# EAGLE design display (EAGLE 6.0)
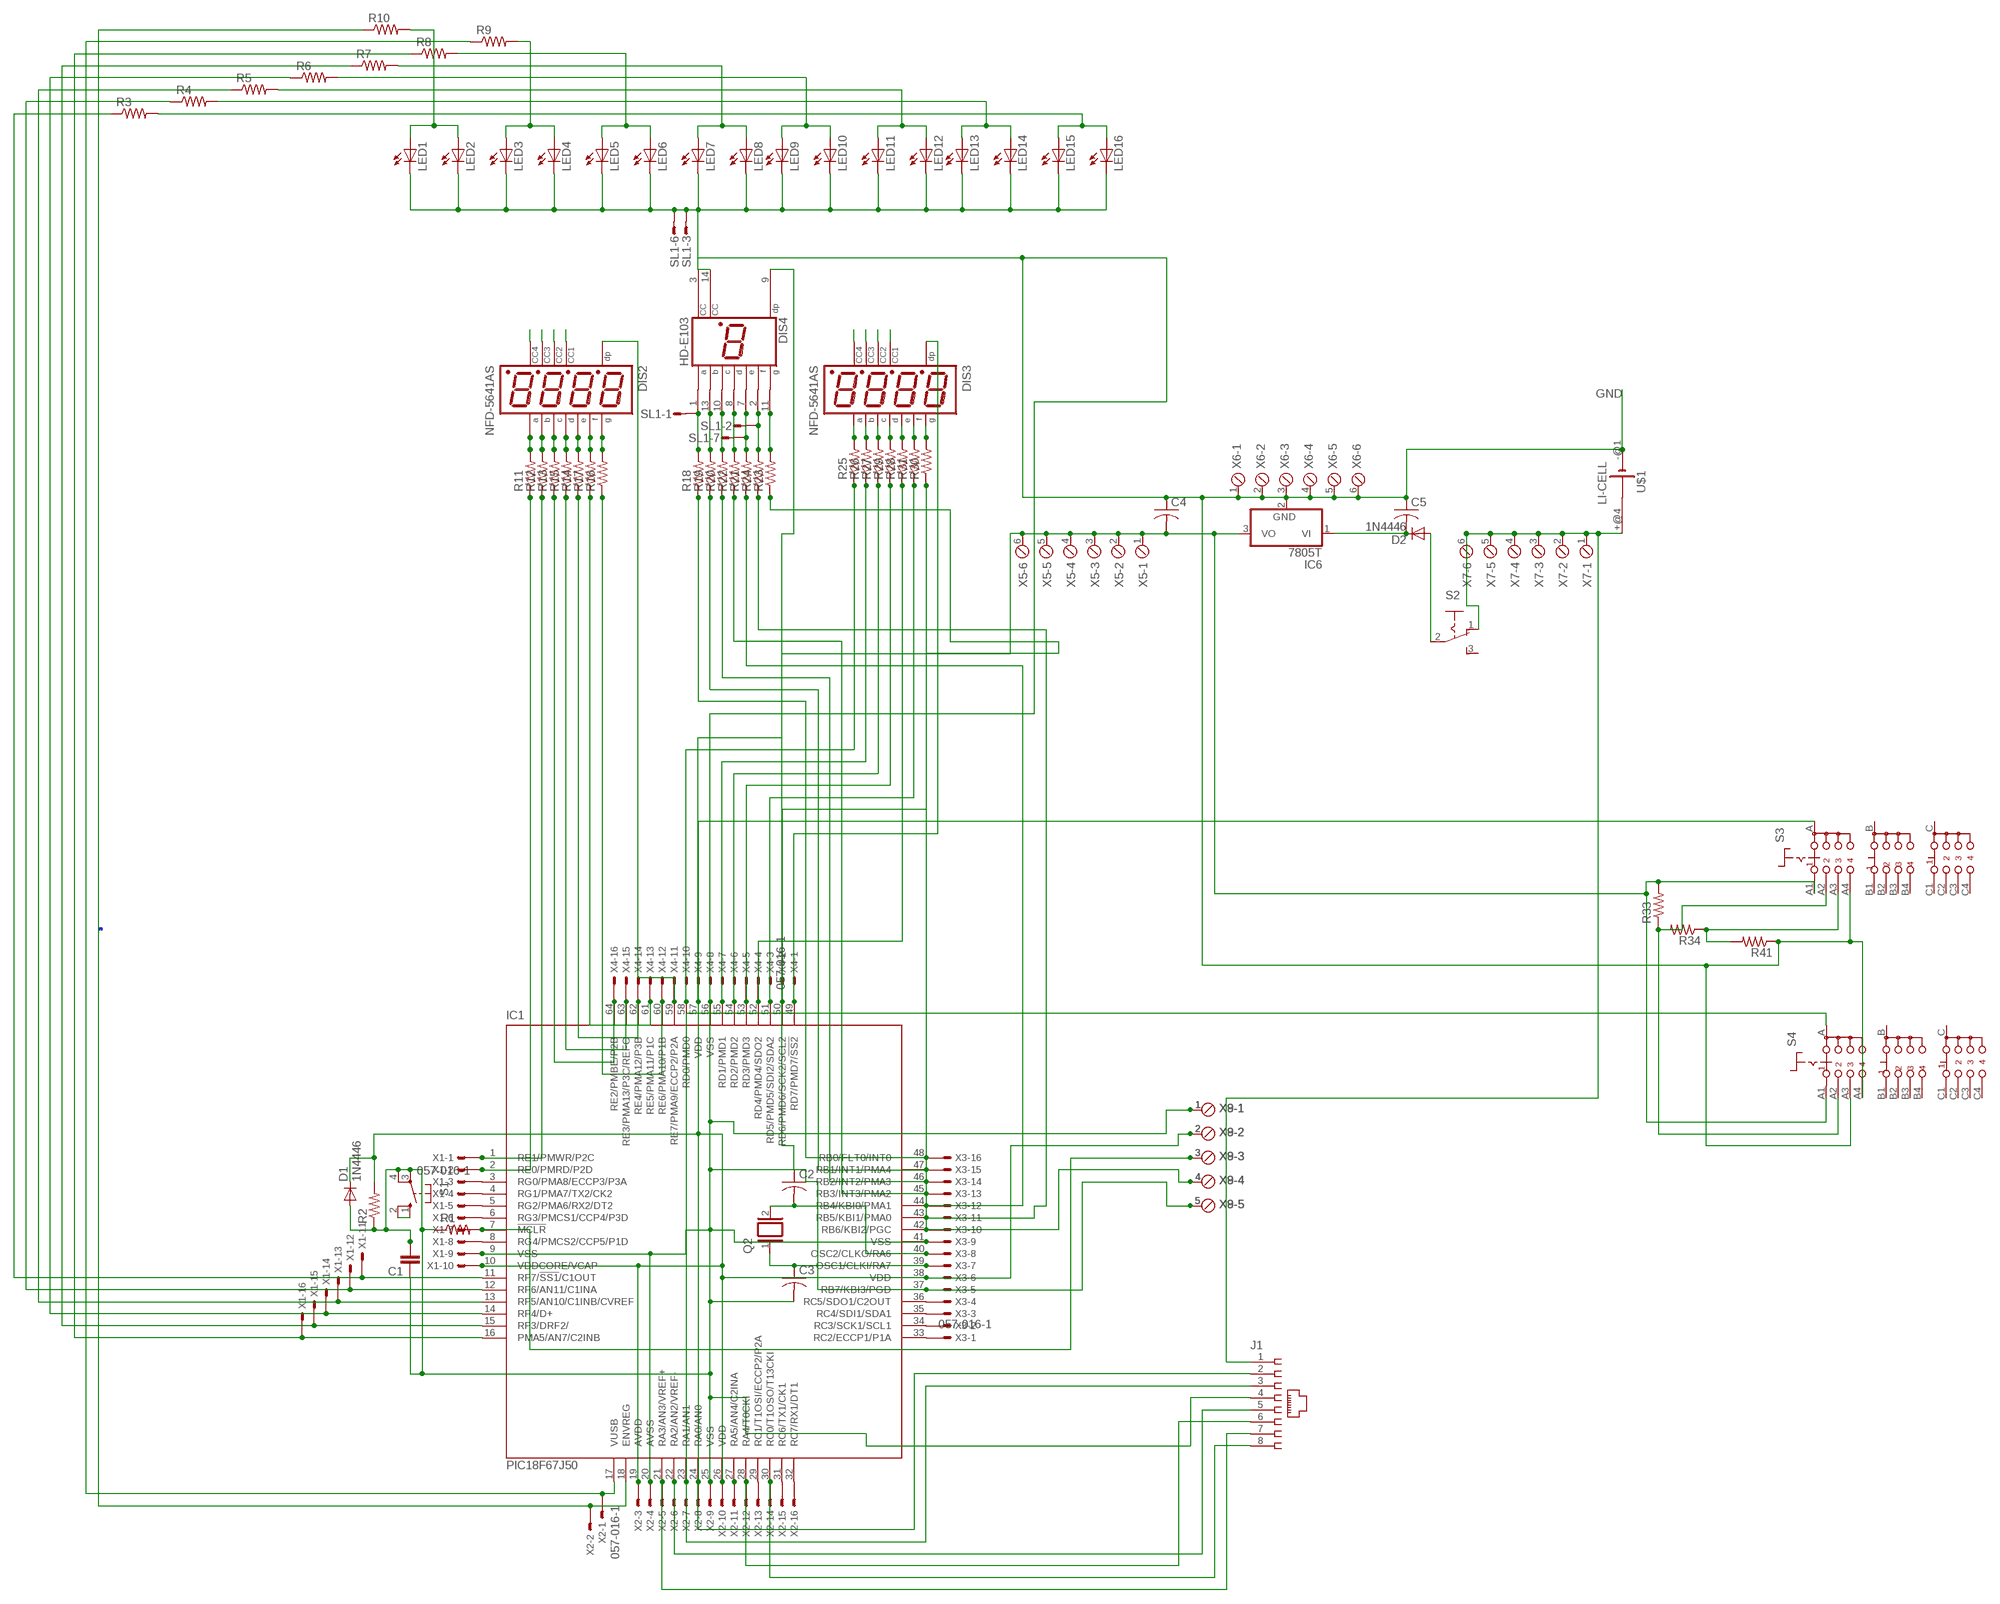
[diagram p0: schematic, sheet 1]

## Parts
C1  C2.5/2  [C2.5-2]
C2  C-US025-024X044  [C025-024X044]
C3  C-US025-024X044  [C025-024X044]
C4  C-US025-024X044  [C025-024X044]
C5  C-US025-024X044  [C025-024X044]
D1  1N4446  [DO35-10]
D2  1N4446  [DO35-10]
DIS2  NFD-5641AS  [NFD-5641]
DIS3  NFD-5641AS  [NFD-5641]
DIS4  HD-E103  [HDSP-I]
IC1  PIC18F67J50  [TQFP64-10X10]
IC6  7805T  [TO220H]
J1  520244-4  [520244-4]
LED1  LED5MM  [LED5MM]
LED2  LED5MM  [LED5MM]
LED3  LED5MM  [LED5MM]
LED4  LED5MM  [LED5MM]
LED5  LED5MM  [LED5MM]
LED6  LED5MM  [LED5MM]
LED7  LED5MM  [LED5MM]
LED8  LED5MM  [LED5MM]
LED9  LED5MM  [LED5MM]
LED10  LED5MM  [LED5MM]
LED11  LED5MM  [LED5MM]
LED12  LED5MM  [LED5MM]
LED13  LED5MM  [LED5MM]
LED14  LED5MM  [LED5MM]
LED15  LED5MM  [LED5MM]
LED16  LED5MM  [LED5MM]
Q2  XTAL/S  [QS]
R1  R-US_0309/10  [0309/10]
R2  R-US_0309/10  [0309/10]
R3  R-US_0207/10  [0207/10]
R4  R-US_0207/10  [0207/10]
R5  R-US_0207/10  [0207/10]
R6  R-US_0207/10  [0207/10]
R7  R-US_0207/10  [0207/10]
R8  R-US_0207/10  [0207/10]
R9  R-US_0207/10  [0207/10]
R10  R-US_0207/10  [0207/10]
R11  R-US_0207/10  [0207/10]
R12  R-US_0207/10  [0207/10]
R13  R-US_0207/10  [0207/10]
R14  R-US_0207/10  [0207/10]
R15  R-US_0207/10  [0207/10]
R16  R-US_0207/10  [0207/10]
R17  R-US_0207/10  [0207/10]
R18  R-US_0207/10  [0207/10]
R19  R-US_0207/10  [0207/10]
R20  R-US_0207/10  [0207/10]
R21  R-US_0207/10  [0207/10]
R22  R-US_0207/10  [0207/10]
R23  R-US_0207/10  [0207/10]
R24  R-US_0207/10  [0207/10]
R25  R-US_0207/10  [0207/10]
R26  R-US_0207/10  [0207/10]
R27  R-US_0207/10  [0207/10]
R28  R-US_0207/10  [0207/10]
R29  R-US_0207/10  [0207/10]
R30  R-US_0207/10  [0207/10]
R31  R-US_0207/10  [0207/10]
R33  R-US_0207/10  [0207/10]
R34  R-US_0207/10  [0207/10]
R41  R-US_0207/10  [0207/10]
S1  10-XX  [B3F-10XX]
S2  255SB  [255SB]
S3  CK103X04  [CK103X04]
S4  CK103X04  [CK103X04]
SL1  M07S  [07P]
U$1  LI-CELL  [LI-CELL]
X1  057-016-1  [057-016-1]
X2  057-016-1  [057-016-1]
X3  057-016-1  [057-016-1]
X4  057-016-1  [057-016-1]
X5  MPT6  [6POL254]
X6  MPT6  [6POL254]
X7  MPT6  [6POL254]
X8  MPT5  [5POL254]
X9  MPT5  [5POL254]

## Nets
GND: C1.1 C1.2 C2.1 C3.2 C4.1 C5.1 D1.A DIS4.3(CC) DIS4.14(CC) IC1.9(VSS) IC1.20(AVSS) IC1.25(VSS) IC1.41(VSS) IC1.56(VSS) IC6.2(GND) J1.4 LED1.K(C) LED2.K(C) LED3.K(C) LED4.K(C) LED5.K(C) LED6.K(C) LED7.K(C) LED8.K(C) LED9.K(C) LED10.K(C) LED11.K(C) LED12.K(C) LED13.K(C) LED14.K(C) LED15.K(C) LED16.K(C) R1.1 R2.1 R41.1 S1.3(P) S1.4(P1) S3.A4 S4.A3 S4.A4 SL1.3 SL1.6 U$1.-@1(-) X1.9 X2.4 X2.9 X3.9 X4.8 X6.1 X6.2 X6.3 X6.4 X6.5 X6.6 X8.1 X9.1
L1: DIS2.P$12
L2: DIS2.P$9
L3: DIS2.P$8
L4: DIS2.P$6
N$1: IC1.7(!MCLR) R1.2 X1.7 X8.3 X9.3
N$2: IC1.18(ENVREG) R10.1 X2.2
N$3: IC1.17(VUSB) R9.1 X2.1
N$4: IC1.16(PMA5/AN7/C2INB) R8.1 X1.16
N$5: IC1.15(RF3/DRF2/) R7.1 X1.15
N$6: IC1.14(RF4/D+) R6.1 X1.14
N$7: IC1.13(RF5/AN10/C1INB/CVREF) R5.1 X1.13
N$8: IC1.12(RF6/AN11/C1INA) R4.1 X1.12
N$9: IC1.11(RF7/!SS1!/C1OUT) R3.1 X1.11
N$10: IC1.3(RG0/PMA8/ECCP3/P3A) X1.3
N$11: DIS2.P$11 R11.2
N$12: DIS4.2(F) R24.2 SL1.2
N$13: IC1.2(RE0/PMRD/P2D) R11.1 X1.2
N$14: DIS2.P$4 R13.2
N$15: DIS3.P$11 R25.2
N$16: DIS2.P$1 R14.2
N$17: DIS4.7(E) R21.2 SL1.7
N$18: DIS2.P$2 R15.2
N$19: DIS2.P$5 R16.2
N$20: IC1.4(RG1/PMA7/TX2/CK2) X1.4
N$21: IC1.28(RA4/T0CKI) J1.6 X2.12
N$22: IC1.5(RG2/PMA6/RX2/DT2) X1.5
N$23: IC1.6(RG3/PMCS1/CCP4/P3D) X1.6
N$24: IC1.1(RE1/PMWR/P2C) R12.1 X1.1
N$25: LED1.A LED2.A R10.2
N$26: IC1.8(RG4/PMCS2/CCP5/P1D) X1.8
N$27: C2.2 IC1.40(OSC2/CLKO/RA6) Q2.2 X3.8
N$28: C3.1 IC1.39(OSC1/CLKI/RA7) Q2.1 X3.7
N$29: R34.1 R41.2 S3.A3
N$30: R24.1 X3.11
N$31: IC1.27(RA5/AN4/C2INA) X2.11
N$32: IC1.29(RC1/T1OSI/ECCP2/P2A) X2.13
N$33: IC1.31(RC6/TX1/CK1) X2.15
N$34: IC1.32(RC7/RX1/DT1) X2.16
N$35: IC1.33(RC2/ECCP1/P1A) X3.1
N$36: DIS2.P$10 R17.2
N$37: IC1.34(RC3/SCK1/SCL1) X3.2
N$38: DIS2.P$7 R12.2
N$39: IC1.35(RC4/SDI1/SDA1) X3.3
N$40: IC1.64(RE2/PMBE/P2B) R13.1 X4.16
N$41: IC1.21(RA3/AN3/VREF+) J1.7 X2.5
N$42: IC1.62(RE4/PMA12/P3B) R14.1 X4.14
N$43: IC1.22(RA2/AN2/VREF-) J1.5 X2.6
N$44: IC1.60(RE6/PMA10/P1B) R16.1 X4.12
N$45: DIS4.1(A) R18.2 SL1.1
N$46: DIS4.10(C) R20.2
N$47: DIS3.P$4 R27.2
N$48: DIS4.8(D) R22.2
N$49: IC1.36(RC5/SDO1/C2OUT) X3.4
N$53: IC1.23(RA1/AN1) J1.3 S4.A X2.7
N$58: IC1.30(RC0/T1OSO/T13CKI) J1.8 X2.14
N$68: DIS4.9(DP) IC1.37(RB7/KBI3/PGD) X3.5 X8.5 X9.5
N$69: IC1.45(RB3/INT3/PMA2) R22.1 X3.13
N$71: IC1.47(RB1/INT1/PMA4) R19.1 X3.15
N$76: DIS3.P$3 IC1.49(RD7/PMD7/!SS2) X4.1
N$77: IC1.53(RD3/PMD3) R29.1 X4.5
N$79: IC1.55(RD1/PMD1) R26.1 X4.7
N$82: IC1.51(RD5/PMD5/SDI2/SDA2) R31.1 X4.3
N$84: DIS2.P$3 IC1.59(RE7/PMA9/ECCP2/P2A) X4.11
N$85: IC1.63(RE3/PMA13/P3C/REFO) R15.1 X4.15
N$87: C5.2 D2.C IC6.1(VI)
N$88: LED3.A LED4.A R9.2
N$89: LED5.A LED6.A R8.2
N$90: LED7.A LED8.A R7.2
N$91: D2.A S2.2(P)
N$92: LED9.A LED10.A R6.2
N$93: LED11.A LED12.A R5.2
N$94: LED13.A LED14.A R4.2
N$95: LED15.A LED16.A R3.2
N$97: S1.1(S) S1.2(S1)
N$99: J1.1 S2.1(O) U$1.+@4(+) X7.1 X7.2 X7.3 X7.4 X7.5 X7.6
N$102: DIS4.11(G) R23.2
N$103: DIS3.P$1 R28.2
N$104: DIS4.13(B) R19.2
N$105: DIS3.P$2 R29.2
N$106: DIS3.P$5 R30.2
N$107: DIS3.P$10 R31.2
N$108: DIS3.P$7 R26.2
N$109: IC1.58(RD0/PMD0) R25.1 X4.10
N$111: IC1.54(RD2/PMD2) R27.1 X4.6
N$113: IC1.52(RD4/PMD4/SDO2) R28.1 X4.4
N$115: IC1.50(RD6/PMD6/SCK2/SCL2) R30.1 X4.2
N$116: IC1.48(RB0/FLT0/INT0) R18.1 X3.16
N$118: IC1.46(RB2/INT2/PMA3) R20.1 X3.14
N$120: IC1.44(RB4/KBI0/PMA1) R21.1 X3.12
N$122: IC1.42(RB6/KBI2/PGC) IC1.43(RB5/KBI1/PMA0) R23.1 X3.10 X8.4 X9.4
N$125: IC1.61(RE5/PMA11/P1C) R17.1 X4.13
N$126: R33.1 R34.2 S3.A2 S4.A2
N$129: C4.2 D1.C IC1.10(VDDCORE/VCAP) IC1.19(AVDD) IC1.26(VDD) IC1.38(VDD) IC6.3(VO) R2.2 R33.2 S3.A1 S4.A1 X1.10 X2.3 X2.10 X3.6 X4.9 X5.1 X5.2 X5.3 X5.4 X5.5 X5.6 X8.2 X9.2
N$134: IC1.24(RA0/AN0) IC1.57(VDD) J1.2 S3.A X2.8
R1: DIS3.P$12
R2: DIS3.P$9
R3: DIS3.P$8
R4: DIS3.P$6
Unconnected: S2.3(S) S3.B S3.B1 S3.B2 S3.B3 S3.B4 S3.C S3.C1 S3.C2 S3.C3 S3.C4 S4.B S4.B1 S4.B2 S4.B3 S4.B4 S4.C S4.C1 S4.C2 S4.C3 S4.C4 SL1.4 SL1.5

## Library data of the parts
C1 = capacitor-wima:C: CAPACITOR naming: grid - package width
C2-C5 = resistor:C-US: CAPACITOR, American symbol
D1 D2 = diode:1N4446: DIODE high speed (Philips)
DIS2 DIS3 = display-nfd:NFD-5641AS: Four Digit 0.56" CC Seven-Segment LED Display Futurlec part number: 7FR5641AS Created by RobG
DIS4 = display-hp:HD-E103: LED DISPLAY 1-character 7 segment, decimal point right
IC1 = microchip:PIC18F6*J5: PIC18F87J50 Family 64/80-Pin High-Performance, 1-Mbit Flash USB Microcontrollers with nanoWatt Technology Source: http://ww1.microchip.com/downloads/en/DeviceDoc/39775b.pdf; MPN: PIC18F67J50-I/PT; OC_FARNELL: 1439559; OC_NEWARK: 17M0972
IC6 = linear:78*: Positive VOLTAGE REGULATOR Source: http://cache.national.com/ds/LM/LM78L05.pdf http://www.fairchildsemi.com/ds/LM/LM7805.pdf
J1 = con-amp:520244-4: AMP connector
LED1-LED16 = led:LED: LED OSRAM: - CHIPLED LG R971, LG N971, LY N971, LG Q971, LY Q971, LO R971, LY R971 LH N974, LH R974 LS Q976, LO Q976, LY Q976 LO Q996 - Hyper CHIPLED LW Q18S LB Q993, LB Q99A, LB R99A - SideLED LS A670, LO A670, LY A670, LG A670, LP A670 LB A673, LV A673, LT A673, LW A673 LH A674 LY A675 LS A676, LA A676, LO A676, LY A676, LW A676 LS A679, LY A679, LG A679 - Hyper Micro SIDELED® LS Y876, LA Y876, LO Y876, LY Y876 LT Y87S - SmartLED LW L88C, LW L88S LB L89C, LB L89S, LG L890 LS L89K, LO L89K, LY L89K LS L896, LA L896, LO L896, LY L896 - TOPLED LS T670, LO T670, LY T670, LG T670, LP T670 LSG T670, LSP T670, LSY T670, LOP T670, LYG T670 LG T671, LOG T671, LSG T671 LB T673, LV T673, LT T673, LW T673 LH T674 LS T676, LA T676, LO T676, LY T676, LB T676, LH T676, LSB T676, LW T676 LB T67C, LV T67C, LT T67C, LS T67K, LO T67K, LY T67K, LW E67C LS E67B, LA E67B, LO E67B, LY E67B, LB E67C, LV E67C, LT E67C LW T67C LS T679, LY T679, LG T679 LS T770, LO T770, LY T770, LG T770, LP T770 LB T773, LV T773, LT T773, LW T773 LH T774 LS E675, LA E675, LY E675, LS T675 LS T776, LA T776, LO T776, LY T776, LB T776 LHGB T686 LT T68C, LB T68C - Hyper Mini TOPLED® LB M676 - Mini TOPLED Santana® LG M470 LS M47K, LO M47K, LY M47K Source: http://www.osram.convergy.de LUXEON: - LUMILED® LXK2-PW12-R00, LXK2-PW12-S00, LXK2-PW14-U00, LXK2-PW14-V00 LXK2-PM12-R00, LXK2-PM12-S00, LXK2-PM14-U00 LXK2-PE12-Q00, LXK2-PE12-R00, LXK2-PE12-S00, LXK2-PE14-T00, LXK2-PE14-U00 LXK2-PB12-K00, LXK2-PB12-L00, LXK2-PB12-M00, LXK2-PB14-N00, LXK2-PB14-P00, LXK2-PB14-Q00 LXK2-PR12-L00, LXK2-PR12-M00, LXK2-PR14-Q00, LXK2-PR14-R00 LXK2-PD12-Q00, LXK2-PD12-R00, LXK2-PD12-S00 LXK2-PH12-R00, LXK2-PH12-S00 LXK2-PL12-P00, LXK2-PL12-Q00, LXK2-PL12-R00 Source: www.luxeon.com KINGBRIGHT: KA-3528ASYC Source: www.kingbright.com
Q2 = special:XTAL/S: CRYSTAL
R1 R2 = resistor:R-US_: RESISTOR, American symbol
R3-R31 R33 R34 R41 = rcl:R-US_: RESISTOR, American symbol
S1 = switch-omron:10-XX: OMRON SWITCH; MPN: B3F-1000; OC_FARNELL: 176432; OC_NEWARK: 36M3542
S2 = switch:255SB: SLIDING SWITCH Distributor Buerklin, 11G810
S3 S4 = switch:CK103X04: ROTARY SWITCH C&K
SL1 = con-amp-quick:M07S: AMP QUICK CONNECTOR; OC_FARNELL: unknown; OC_NEWARK: unknown
U$1 = orion:LI-CELL
X1-X4 = con-panduit:057-016-: CONNECTOR 10-pin series 057 contact pc board low profile headers; OC_FARNELL: unknown; OC_NEWARK: unknown
X5-X7 = con-phoenix-254:MPT6: PHOENIX CONNECTOR; OC_FARNELL: unknown; OC_NEWARK: unknown
X8 X9 = con-phoenix-254:MPT5: PHOENIX CONNECTOR; OC_FARNELL: unknown; OC_NEWARK: unknown

## Board
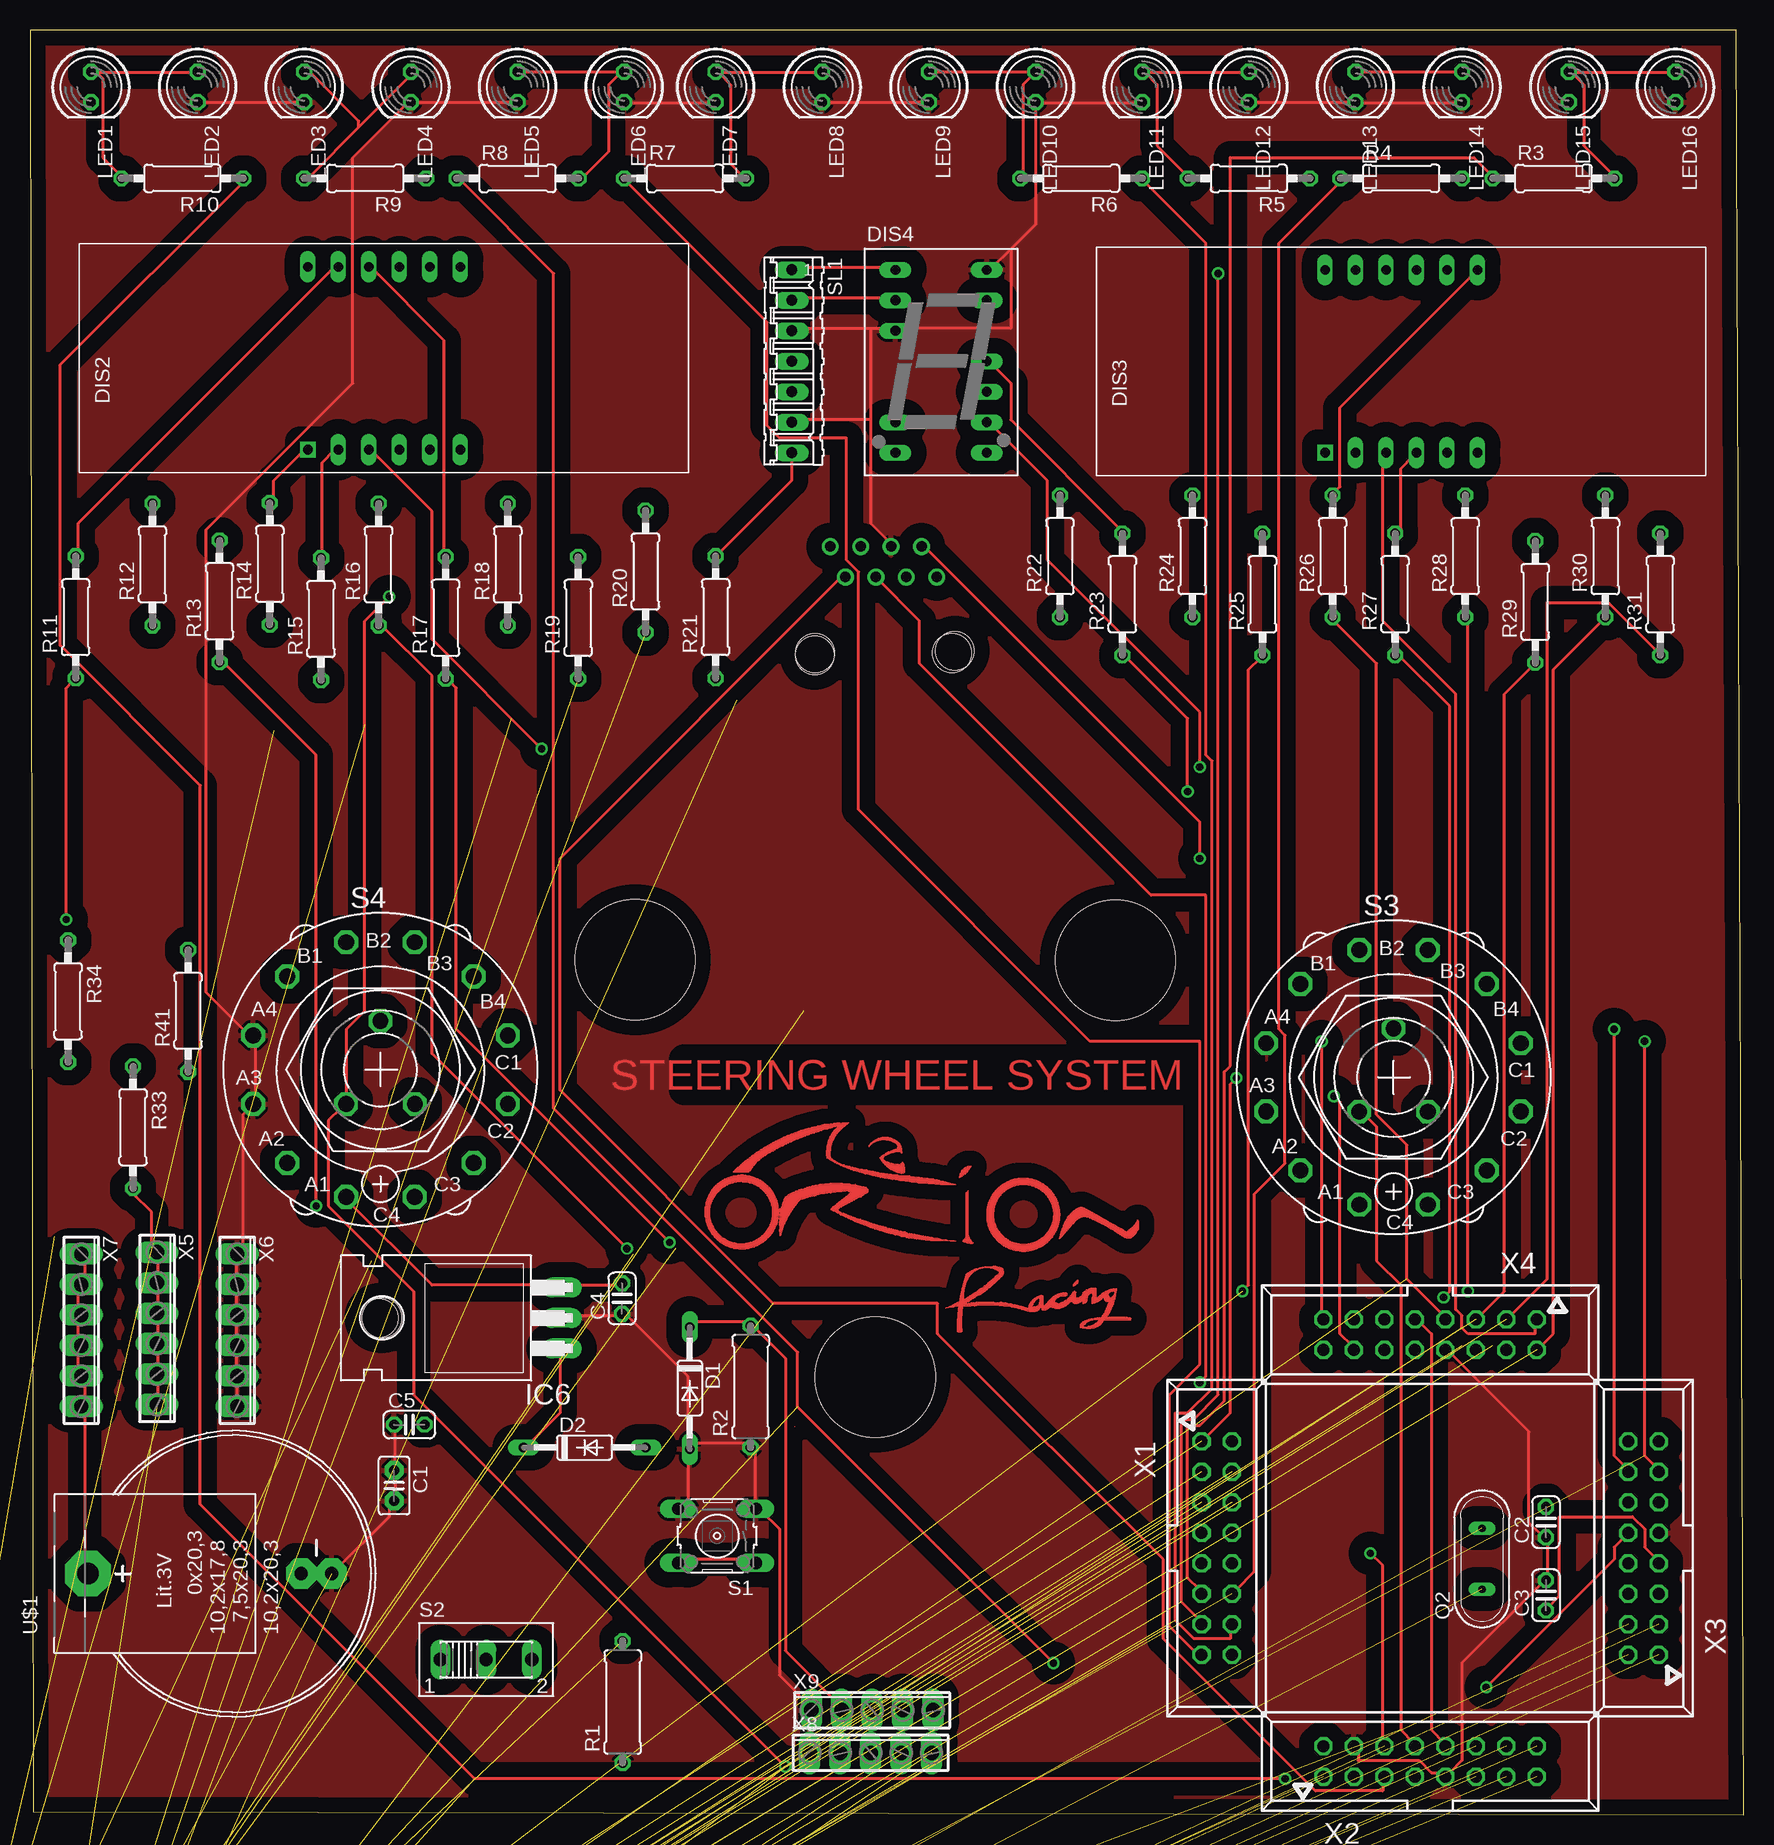
[diagram p1: board, top side]
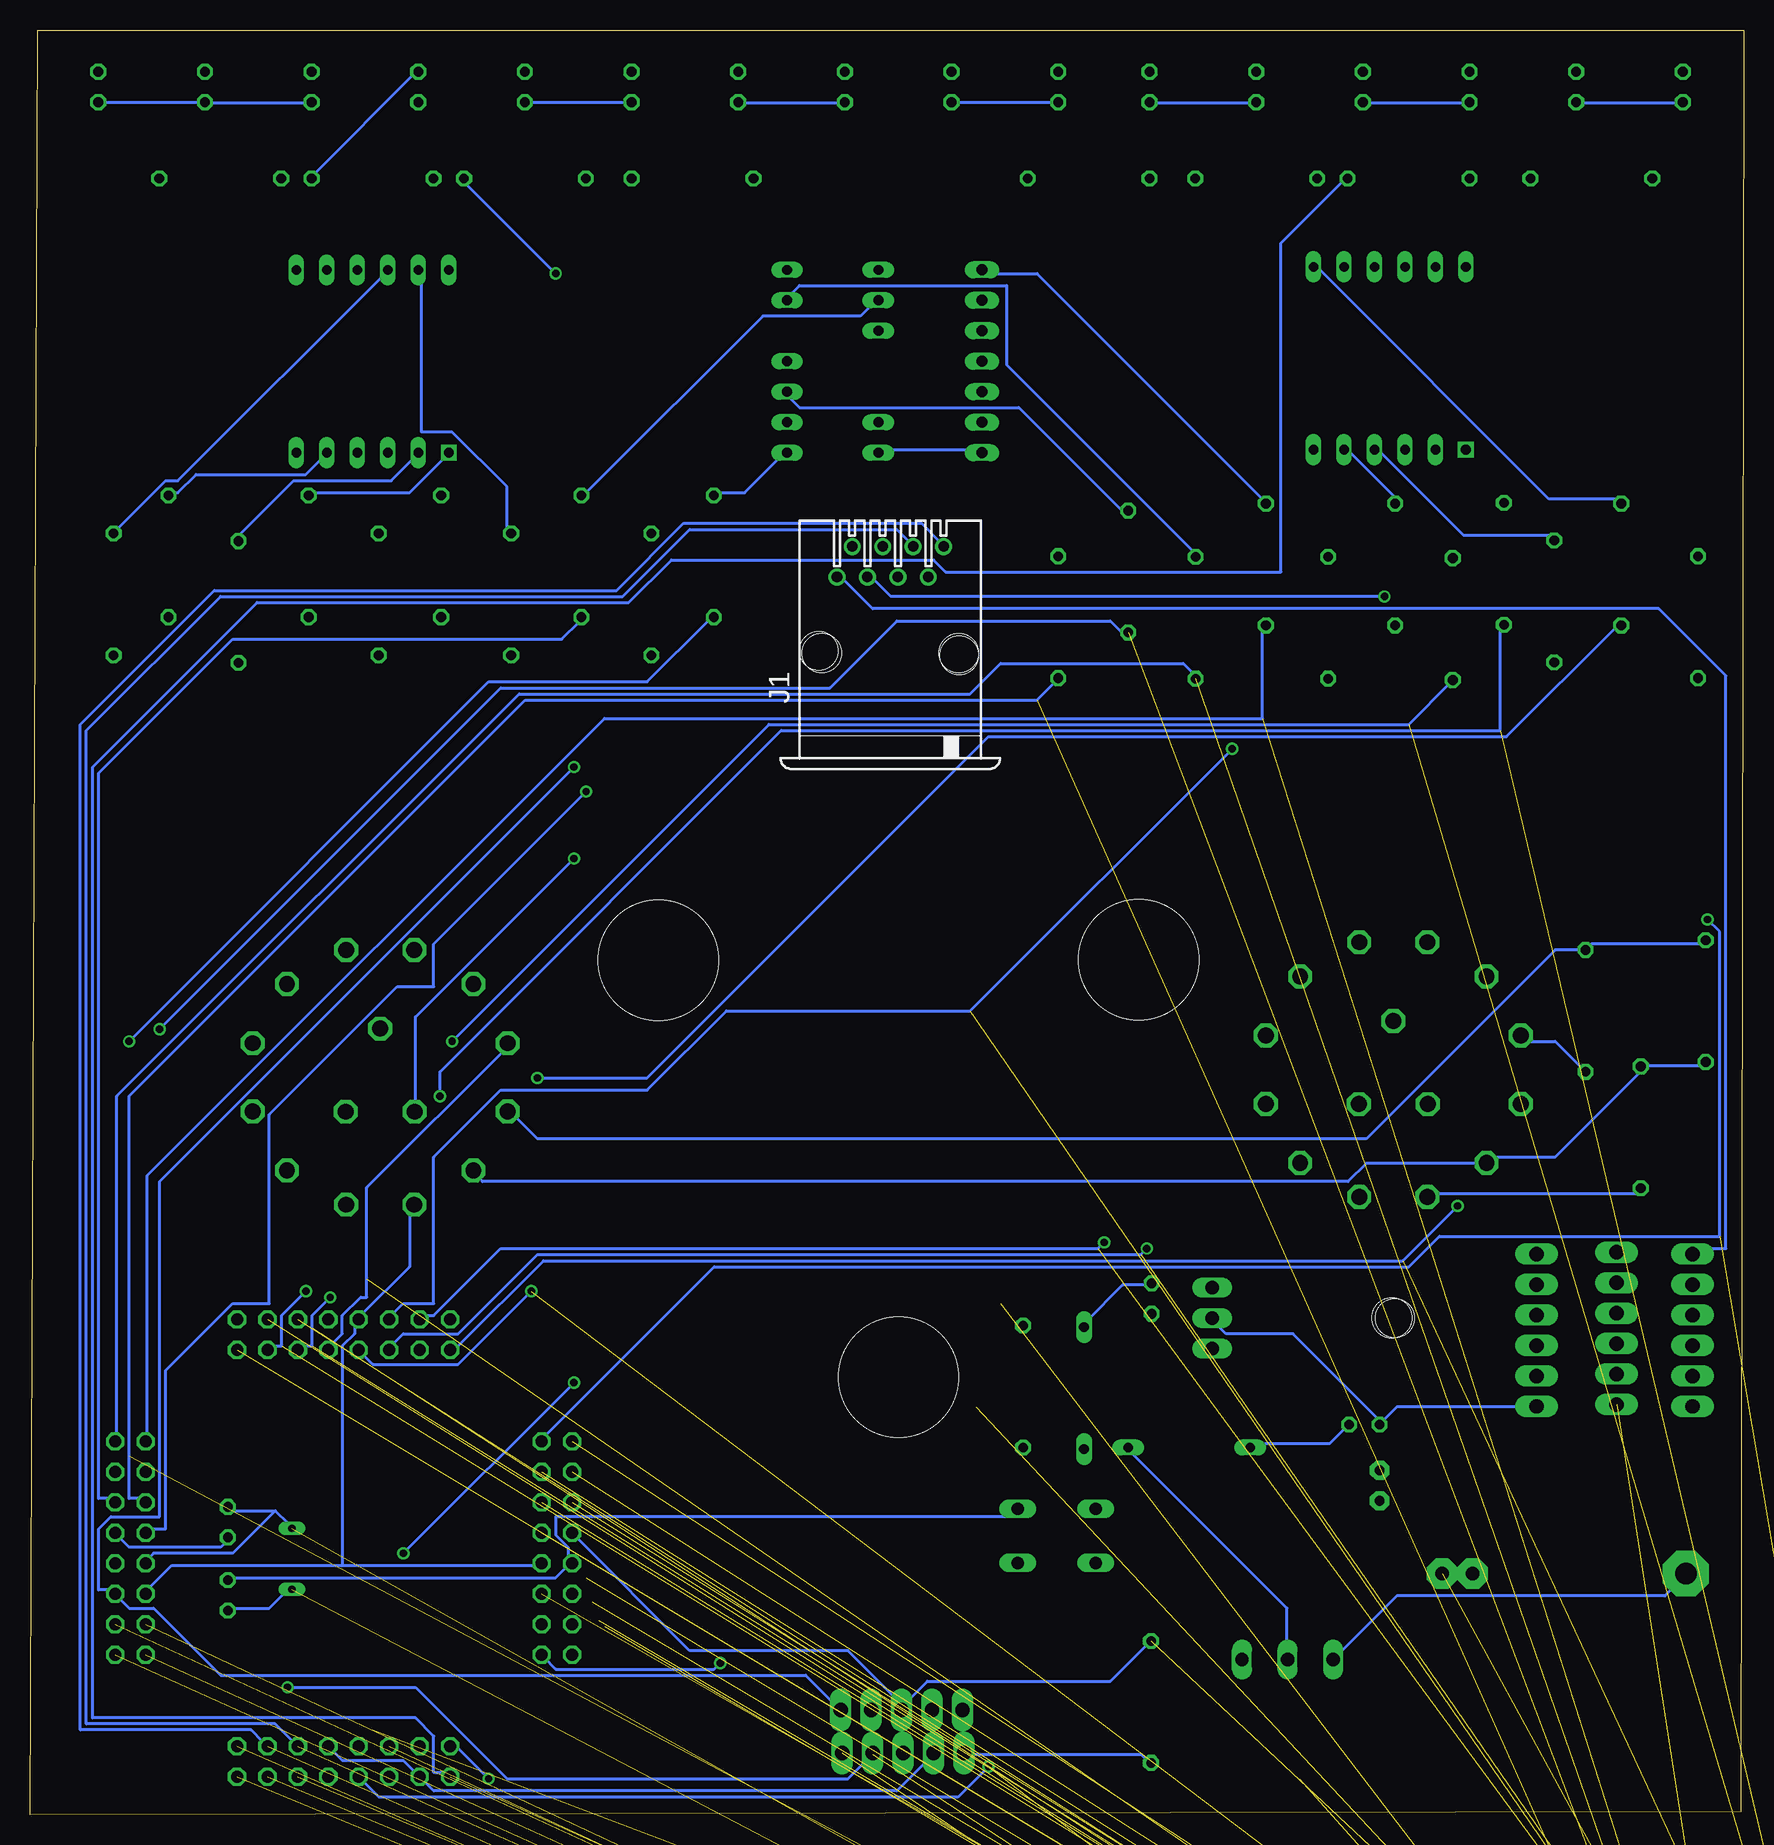
[diagram p2: board, bottom side, seen from below]

Size 142.86 x 148.77 mm. Coordinates in mm from the lower left corner, seen from the top.
Outline: 0.25,0.25 142.85,0 142.22,148.77 0,148.77 0.25,0.25
Copper layers (1*16): Top 0.035mm / dielectric 1.5mm / Bottom 0.035mm
Design rules: minimum track width 10mil, minimum drill 24mil, track to track 8mil, track to pad 8mil, pad to pad 8mil, via to via 8mil, smd to smd 8mil, copper to edge 40mil, drill to drill 20mil, minimum pad ring 10mil, minimum via ring 8mil, stop-mask expansion 4mil, vias tented up to drill 0mil, thermal gap 10mil
Holes 3.2 mm at 29.08,41.4 77.09,97.03 65.41,96.65
Holes 10 mm at 70.46,36.47 90.47,71.22 50.44,71.27

### Footprints (pad centres in the part's own frame; a part is rotated, then mirrored left to right if it is on the bottom)
C2.5-2 = drill 0.813 pad 1.6 octagon: 1 -1.27,0; 2 1.27,0
C025-024X044 = drill 0.813 octagon: 1 -1.27,0; 2 1.27,0
DO35-10 = drill 0.813 long: A 5.08,0; C -5.08,0
NFD-5641 = drill 0.8 square: P$1 -6.35,-7.62 | drill 0.8 long: P$2 -3.81,-7.62; P$3 -1.27,-7.62; P$4 1.27,-7.62; P$5 3.81,-7.62; P$6 6.35,-7.62; P$7 6.35,7.62; P$8 3.81,7.62; P$9 1.27,7.62; P$10 -1.27,7.62; P$11 -3.81,7.62; P$12 -6.35,7.62
HDSP-I = drill 0.813 long: 1 -3.81,7.62; 2 -3.81,5.08; 3 -3.81,2.54; 6 -3.81,-5.08; 7 -3.81,-7.62; 8 3.81,-7.62; 9 3.81,-5.08; 10 3.81,-2.54; 11 3.81,0; 13 3.81,5.08; 14 3.81,7.62
TQFP64-10X10 = smd 1.2 x 0.3: 1 -5.7,3.75; 2 -5.7,3.25; 3 -5.7,2.75; 4 -5.7,2.25; 5 -5.7,1.75; 6 -5.7,1.25; 7 -5.7,0.75; 8 -5.7,0.25; 9 -5.7,-0.25; 10 -5.7,-0.75; 11 -5.7,-1.25; 12 -5.7,-1.75; 13 -5.7,-2.25; 14 -5.7,-2.75; 15 -5.7,-3.25; 16 -5.7,-3.75; 33 5.7,-3.75; 34 5.7,-3.25; 35 5.7,-2.75; 36 5.7,-2.25; 37 5.7,-1.75; 38 5.7,-1.25; 39 5.7,-0.75; 40 5.7,-0.25; 41 5.7,0.25; 42 5.7,0.75; 43 5.7,1.25; 44 5.7,1.75; 45 5.7,2.25; 46 5.7,2.75; 47 5.7,3.25; 48 5.7,3.75 | smd 0.3 x 1.2: 17 -3.75,-5.7; 18 -3.25,-5.7; 19 -2.75,-5.7; 20 -2.25,-5.7; 21 -1.75,-5.7; 22 -1.25,-5.7; 23 -0.75,-5.7; 24 -0.25,-5.7; 25 0.25,-5.7; 26 0.75,-5.7; 27 1.25,-5.7; 28 1.75,-5.7; 29 2.25,-5.7; 30 2.75,-5.7; 31 3.25,-5.7; 32 3.75,-5.7; 49 3.75,5.7; 50 3.25,5.7; 51 2.75,5.7; 52 2.25,5.7; 53 1.75,5.7; 54 1.25,5.7; 55 0.75,5.7; 56 0.25,5.7; 57 -0.25,5.7; 58 -0.75,5.7; 59 -1.25,5.7; 60 -1.75,5.7; 61 -2.25,5.7; 62 -2.75,5.7; 63 -3.25,5.7; 64 -3.75,5.7
TO220H = drill 1.118 long: 1 -2.54,-10.16; 2 0,-10.16; 3 2.54,-10.16 | hole 3.302: 0,4.826
520244-4 = drill 0.889: 1 -4.445,6.35; 2 -3.175,8.89; 3 -1.905,6.35; 4 -0.635,8.89; 5 0.635,6.35; 6 1.905,8.89; 7 3.175,6.35; 8 4.445,8.89 | hole 3.251: -5.715,0; 5.715,0
LED5MM = drill 0.813 octagon: A -1.27,0; K 1.27,0
QS = drill 0.61 long: 1 -2.54,0; 2 2.54,0
0309/10 = drill 0.813 octagon: 1 -5.08,0; 2 5.08,0
0207/10 = drill 0.813 octagon: 1 -5.08,0; 2 5.08,0
B3F-10XX = drill 1.016 long: 1 -3.251,2.261; 2 3.251,2.261; 3 -3.251,-2.261; 4 3.251,-2.261
255SB = drill 1.118 long: 1 -3.81,0; 2 0,0; 3 3.81,0
CK103X04 = drill 1.321 octagon: A -2.87,-2.87; A1 -2.845,-10.617; A2 -7.772,-7.772; A3 -10.617,-2.845; A4 -10.617,2.845; B 0,4.059; B1 -7.772,7.772; B2 -2.845,10.617; B3 2.845,10.617; B4 7.772,7.772; C 2.87,-2.87; C1 10.617,2.845; C2 10.617,-2.845; C3 7.772,-7.772; C4 2.845,-10.617
07P = drill 0.914 long: 1 -7.62,0; 2 -5.08,0; 3 -2.54,0; 4 0,0; 5 2.54,0; 6 5.08,0; 7 7.62,0
LI-CELL = drill 1.803 pad 3.81 octagon: +@4 1.27,9.525 | drill 1.118 pad 2.54 octagon: - 1.27,-8.255; -@1 1.27,-10.795
057-016-1 = drill 1 octagon: 1 -8.89,-1.27; 2 -8.89,1.27; 3 -6.35,-1.27; 4 -6.35,1.27; 5 -3.81,-1.27; 6 -3.81,1.27; 7 -1.27,-1.27; 8 -1.27,1.27; 9 1.27,-1.27; 10 1.27,1.27; 11 3.81,-1.27; 12 3.81,1.27; 13 6.35,-1.27; 14 6.35,1.27; 15 8.89,-1.27; 16 8.89,1.27
6POL254 = drill 1.2 pad 1.778 long: 1 -6.35,0; 2 -3.81,0; 3 -1.27,0; 4 1.27,0; 5 3.81,0; 6 6.35,0
5POL254 = drill 1.2 long: 1 -5.08,0; 2 -2.54,0; 3 0,0; 4 2.54,0; 5 5.08,0

### Placement (x,y rotation side)
C1  30.35,27.43 270 top
C2  126.36,24.38 90 top
C3  126.36,18.29 90 top
C4  49.35,43.03 90 top
C5  31.62,32.51 0 top
D1  54.99,35.56 270 top
D2  46.23,30.61 0 top
DIS2  29.51,121.41 0 top
DIS3  114.3,121.16 0 top
DIS4  75.95,121.16 0 top
IC1  -7.52,-44.88 0 top  (outside the outline)
IC6  34.16,41.4 90 top
J1  71.15,96.82 0 bottom
LED1  5.08,144.02 270 top
LED2  13.97,144.02 270 top
LED3  22.86,144.02 270 top
LED4  31.75,144.02 270 top
LED5  40.64,144.02 270 top
LED6  49.53,144.02 270 top
LED7  57.15,144.02 270 top
LED8  66.04,144.02 270 top
LED9  74.93,144.02 270 top
LED10  83.82,144.02 270 top
LED11  92.71,144.02 270 top
LED12  101.6,144.02 270 top
LED13  110.49,144.02 270 top
LED14  119.38,144.02 270 top
LED15  128.27,144.02 270 top
LED16  137.16,144.02 270 top
Q2  121.03,21.34 90 top
R1  49.4,9.4 90 top
R2  60.07,35.69 90 top
R3  127,136.4 0 top
R4  114.3,136.4 0 top
R5  101.6,136.4 180 top
R6  87.63,136.4 180 top
R7  54.61,136.4 0 top
R8  40.64,136.4 0 top
R9  27.94,136.4 180 top
R10  12.7,136.4 180 top
R11  3.81,99.82 90 top
R12  10.21,104.22 90 top
R13  15.8,101.14 90 top
R14  19.99,104.27 90 top
R15  24.26,99.67 90 top
R16  29.06,104.22 90 top
R17  34.65,99.77 90 top
R18  39.83,104.22 90 top
R19  45.69,99.77 90 top
R20  51.31,103.63 90 top
R21  57.15,99.82 90 top
R22  85.85,104.9 90 top
R23  91.06,101.73 90 top
R24  96.9,104.9 90 top
R25  102.74,101.73 90 top
R26  108.58,104.9 90 top
R27  113.79,101.73 90 top
R28  119.63,104.9 90 top
R29  125.48,101.09 90 top
R30  131.32,104.9 90 top
R31  135.89,101.73 90 top
R33  8.59,57.3 270 top
R34  3.17,67.82 270 top
R41  13.18,67.01 90 top
S1  57.28,23.24 180 top
S2  38.02,12.93 0 top
S3  113.66,61.47 0 top
S4  29.21,62.1 0 top
SL1  63.5,121.16 270 top
U$1  14.35,18.82 90 top
X1  98.93,22.22 270 top
X2  116.71,4.45 0 top
X3  134.49,22.22 90 top
X4  116.71,40 180 top
X5  10.59,40.54 270 top
X6  17.27,40.39 270 top
X7  4.27,40.39 270 top
X8  70.08,5.16 0 top
X9  70.21,8.71 0 top

### Tracks (layer width: path | path; a pad name or v marks a point on that pad's centre or on a via)
GND  (5 unrouted)
  Top 0.254: LED2.K 14.2,142.7 22.83,142.7 LED3.K | LED8.K 66.52,142.7 74.65,142.7 LED9.K | LED7.K 56.87,142.7 49.76,142.7 LED6.K | LED5.K 40.61,142.7 31.98,142.7 LED4.K 31.47,142.7 26.9,138.13 26.9,119.33 14.71,107.14 14.71,68.53 18.26,64.97 S4.A4 18.77,64.47 18.77,59.39 S4.A3 18.26,58.88 17.75,58.37 17.75,47.19 X6.1 17.25,46.69 17.25,44.65 X6.2 17.25,44.15 17.25,42.11 X6.3 17.25,41.61 17.25,39.57 X6.4 17.25,39.07 17.25,37.03 X6.5 17.25,36.53 17.25,34.49 X6.6 | 70.08,123.9 63.98,123.9 SL1.3 | 70.08,123.9 72.11,123.9 DIS4.3 72.62,123.9 81.76,123.9 81.76,130.51 | 70.08,123.9 70.08,116.28 | 70.08,116.28 70.08,107.65 71.6,106.12 J1.4 | 70.08,116.28 63.98,116.28 SL1.6 | LED12.K 102.08,142.7 110.21,142.7 LED13.K 110.72,142.7 119.35,142.7 LED14.K | 81.76,130.51 83.79,132.54 83.79,142.7 LED10.K 84.3,142.7 92.43,142.7 LED11.K | 81.76,130.51 80.24,128.98 DIS4.14 | X2.4 110.72,5.54 110.72,4.52 115.8,4.52 116.81,3.51 117.83,3.51 X2.9 118.34,3.51 119.35,4.52 119.35,12.65 125.96,19.25 C3.2 126.47,19.76 126.47,22.81 C2.1 125.96,23.32 124.94,24.33 124.94,31.95 118.34,38.56 X4.8 | X8.1 65,8.59 X9.1 65,9.09 62.46,11.63 62.46,23.83 60.93,25.35 S1.3 60.43,25.86 60.43,30.43 R2.1 59.92,30.94 55.35,30.94 D1.A | IC6.2 44.68,41.61 49.25,41.61 C4.1 49.76,41.61 54.84,36.53 54.84,30.94 D1.A | S1.4 54.33,25.86 54.84,26.37 54.84,30.43 D1.A | C5.1 30.45,32.46 30.45,28.91 C1.1 30.45,28.4 30.45,26.37 C1.2 29.95,25.86 29.95,24.84 25.37,20.27 U$1.-@1
  Bottom 0.254: LED1.K 5.56,142.7 13.69,142.7 LED2.K | LED3.K 23.34,142.7 31.47,142.7 LED4.K | LED5.K 41.12,142.7 49.25,142.7 LED6.K | LED8.K 66.01,142.7 57.38,142.7 LED7.K | LED14.K 119.86,142.7 127.99,142.7 LED15.K 128.5,142.7 137.13,142.7 LED16.K | LED12.K 101.57,142.7 92.94,142.7 LED11.K | LED9.K 75.16,142.7 83.79,142.7 LED10.K | C3.2 125.96,19.76 99.03,19.76 98.02,20.78 X1.9 98.02,21.29 98.02,22.3 99.03,23.32 99.03,24.84 61.44,24.84 60.93,25.35 S1.3 | X3.9 135.61,23.32 134.59,22.3 126.97,22.3 126.47,22.81 C2.1 | S3.A4 103.1,63.96 114.78,52.27 114.78,43.13 115.29,43.13 116.81,41.61 116.81,40.08 117.83,39.07 X4.8 | R1.1 49.76,4.52 50.27,5.03 65,5.03 X8.1 | R41.1 15.72,64.47 18.26,64.47 S4.A4 | X6.6 17.75,33.99 28.93,33.99 29.95,32.97 C5.1 30.45,32.97 37.57,40.08 43.15,40.08 44.17,41.1 IC6.2
  pour Top (isolate 1.27): -0.13,148.84 142.54,148.84 142.8,-0.48 0.13,-0.48
N$1  (1 unrouted)
  Top 0.254: 97.51,23.83 X1.7 | X8.3 70.08,8.59 X9.3
  Bottom 0.254: 70.08,9.09 68.05,11.13 52.81,11.13 49.76,14.17 R1.2 | 70.08,9.09 74.65,13.67 87.86,13.67 97.51,23.32 X1.7 | 70.08,9.09 X9.3
N$2  (via drill 0.61)  (1 unrouted)
  Top 0.254: v104.62,3 37.06,3 14.2,25.86 14.2,85.8 2.51,97.49 2.51,120.85 17.75,136.09 R10.1
  Bottom 0.254: v104.62,3 107.16,5.54 107.67,5.54 X2.2
N$3  (1 unrouted)
  Bottom 0.254: R9.1 33.5,136.09 38.58,131.01 38.58,103.58 66.52,103.58 67.54,104.6 89.38,104.6 92.94,101.04 123.93,101.04 137.64,87.33 137.64,8.08 110.72,8.08 109.19,6.55 109.19,3.51 108.18,3.51 X2.1
N$4  (via drill 0.61)  (1 unrouted)
  Top 0.254: v85.32,12.65 63.98,33.99 63.98,38.56 43.66,58.88 43.66,128.47 36.04,136.09 R8.1
  Bottom 0.254: v85.32,12.65 85.83,12.14 99.03,12.14 100.05,13.16 X1.16
N$5  (1 unrouted)
  Top 0.254: R7.1 49.76,136.09 61.44,124.41 61.44,115.77 62.46,114.76 68.05,114.76 68.05,104.6 69.06,103.58 69.06,83.77 88.37,64.47 97.51,64.47 97.51,37.54 94.97,35 94.97,15.7 97.51,13.16 X1.15
N$6  (1 unrouted)
  Top 0.254: R6.1 92.94,136.09 98.02,131.01 98.02,88.34 98.53,87.83 98.53,35.51 96.49,33.48 95.48,33.48 95.48,16.21 97,14.68 100.05,14.68 100.05,15.7 X1.14
N$7  (via drill 0.61)  (1 unrouted)
  Top 0.254: v99.03,128.47 99.03,35 97,32.97 95.99,32.97 95.99,17.73 97.51,16.21 X1.13
  Bottom 0.254: v99.03,128.47 106.65,136.09 R5.1
N$8  (1 unrouted)
  Top 0.254: R4.1 109.19,136.09 104.11,131.01 104.11,65.48 104.62,64.97 104.62,54.31 102.08,51.77 102.08,20.27 100.56,18.75 X1.12
N$9  (1 unrouted)
  Top 0.254: R3.1 121.89,136.6 120.37,138.13 100.05,138.13 100.05,62.43 99.54,61.93 99.54,34.49 97.51,32.46 96.49,32.46 96.49,19.76 97.51,18.75 X1.11
N$10  (1 unrouted)
N$11
  Top 0.254: DIS2.P$11 25.37,128.98 4.04,107.65 4.04,105.11 R11.2
N$12
  Top 0.254: DIS4.2 72.11,126.44 63.98,126.44 SL1.2
  Bottom 0.254: R24.2 96.49,110.19 81.76,124.92 73.63,124.92 72.62,125.93 DIS4.2
N$13  (via drill 0.61)  (1 unrouted)
  Top 0.254: v3.02,74.63 3.02,93.93 3.53,94.44 R11.1
  Bottom 0.254: v3.02,74.63 2.01,73.61 2.01,48.21 25.37,48.21 27.91,45.67 85.83,45.67 100.05,31.45 X1.2
N$14
  Bottom 0.254: DIS2.P$4 30.45,113.74 23.34,106.63 16.23,106.63 R13.2
N$15
  Bottom 0.254: DIS3.P$11 110.21,128.47 110.21,115.27 107.67,115.27 103.1,110.69 103.1,107.14 R25.2
N$16
  Top 0.254: DIS2.P$1 22.83,113.74 20.29,111.2 20.29,109.68 R14.2
N$17
  Top 0.254: R21.2 57.38,105.11 63.47,111.2 63.47,113.23 SL1.7
  Bottom 0.254: DIS4.7 72.11,113.74 63.98,113.74 SL1.7
N$18
  Top 0.254: DIS2.P$2 25.37,113.74 24.36,112.73 24.36,105.11 R15.2
N$19
  Bottom 0.254: DIS2.P$5 32.99,113.74 28.93,109.68 R16.2
N$20  (1 unrouted)
N$21  (1 unrouted)
  Bottom 0.254: J1.6 69.57,106.12 70.59,107.14 87.86,107.14 93.45,101.55 126.97,101.55 138.15,90.37 138.15,7.57 122.4,7.57 120.88,6.05 X2.12
N$22  (1 unrouted)
N$23  (1 unrouted)
N$24  (via drill 0.61)  (1 unrouted)
  Top 0.254: v100.56,61.42 100.05,60.91 100.05,33.48 98.02,31.45 X1.1
  Bottom 0.254: v100.56,61.42 91.41,61.42 62.97,89.87 19.79,89.87 10.64,99.01 R12.1
N$25
  Top 0.254: 5.56,145.24 6.07,144.73 6.07,138.13 7.59,136.6 R10.2 | 5.56,145.24 13.69,145.24 LED2.A | 5.56,145.24 LED1.A
N$26  (1 unrouted)
N$27  (1 unrouted)
  Bottom 0.254: 122.4,25.35 121.39,24.33 Q2.2 | 122.4,25.35 125.96,25.35 C2.2 | 122.4,25.35 125.96,21.79 132.56,21.79 133.07,21.29 X3.8
N$28  (1 unrouted)
  Top 0.254: X3.7 135.61,21.29 134.59,22.3 134.59,23.83 133.58,24.84 127.48,24.84 127.48,18.24 126.47,17.22 C3.1
  Bottom 0.254: Q2.1 121.39,18.75 122.91,17.22 125.96,17.22 C3.1
N$29
  Bottom 0.254: R34.1 3.53,72.59 12.67,72.59 R41.2 15.72,72.09 31.47,56.34 100.56,56.34 102.59,58.37 S3.A3
N$30
  Bottom 0.254: R24.1 97,99.52 98.53,97.99 125.96,97.99 137.13,86.82 137.13,26.37 136.12,26.37 X3.11
N$31  (1 unrouted)
N$32  (1 unrouted)
N$33  (1 unrouted)
N$34  (1 unrouted)
N$35  (1 unrouted)
N$36
  Top 0.254: DIS2.P$10 28.42,128.98 34.52,122.89 34.52,105.11 R17.2
N$37  (1 unrouted)
N$38
  Bottom 0.254: DIS2.P$7 35.53,128.98 16.23,109.68 10.64,109.68 R12.2
N$39  (1 unrouted)
N$40  (via drill 0.61)  (1 unrouted)
  Top 0.254: v23.85,50.75 23.85,88.34 16.23,95.96 R13.1
  Bottom 0.254: v23.85,50.75 28.42,46.18 100.05,46.18 107.16,39.07 107.67,39.07 X4.16
N$41  (1 unrouted)
  Top 0.254: J1.7 67.54,103.07 44.17,79.71 44.17,60.4 61.95,42.62 75.67,42.62 75.67,40.08 94.46,21.29 94.46,14.68 107.16,1.98 112.75,1.98 112.75,3 X2.5
N$42  (via drill 0.61)  (1 unrouted)
  Top 0.254: v108.69,59.89 109.19,59.39 109.19,40.08 110.21,39.07 X4.14
  Bottom 0.254: v108.69,59.89 108.69,61.93 80.24,90.37 20.29,90.37 20.29,99.01 R14.1
N$43  (via drill 0.61)  (1 unrouted)
  Top 0.254: v97.51,36.02 98.02,36.53 98.02,76.66 93.45,76.66 74.14,95.96 74.14,99.52 70.59,103.07 J1.5 | v111.73,21.79 112.75,20.78 112.75,6.05 X2.6
  Bottom 0.254: v111.73,21.79 v97.51,36.02
N$44  (via drill 0.61)  (1 unrouted)
  Top 0.254: v49.76,47.19 33.5,63.45 33.5,94.95 29.44,99.01 R16.1
  Bottom 0.254: v49.76,47.19 50.27,46.69 100.56,46.69 107.16,40.08 111.73,40.08 112.75,39.07 X4.12
N$45
  Top 0.254: DIS4.1 72.11,128.98 63.98,128.98 SL1.1
  Bottom 0.254: R18.2 40.11,109.68 58.9,128.47 63.47,128.47 SL1.1
N$46
  Bottom 0.254: R20.2 51.79,108.66 60.43,117.3 78.71,117.3 79.73,118.31 DIS4.10
N$47
  Top 0.254: DIS3.P$4 115.29,113.23 114.27,112.22 114.27,107.14 R27.2
N$48
  Bottom 0.254: DIS4.8 80.24,113.23 83.29,110.19 85.83,110.19 R22.2
N$49  (1 unrouted)
N$53  (via drill 0.61)  (1 unrouted)
  Top 0.254: v29.95,101.55 27.91,99.52 27.91,67.01 26.39,65.48 26.39,59.39 S4.A 25.88,58.88 24.87,57.86 24.87,50.75 31.98,43.64 31.98,35 v62.97,4.01
  Bottom 0.254: v29.95,101.55 71.09,101.55 72.62,103.07 J1.3 | v62.97,4.01 65.51,1.47 113.77,1.47 115.29,3 X2.7
N$58  (1 unrouted)
  Bottom 0.254: J1.8 67.03,106.12 68.55,107.65 88.37,107.65 93.95,102.06 127.48,102.06 138.66,90.88 138.66,7.06 124.43,7.06 123.42,6.05 X2.14
N$68  (via drill 0.61)  (1 unrouted)
  Top 0.254: X8.5 75.16,8.59 X9.5 | v97.51,87.33 97.51,91.9 84.81,104.6 84.81,111.2 80.24,115.77 DIS4.9
  Bottom 0.254: v97.51,87.33 132.05,52.78 132.05,24.84 136.12,24.84 137.13,23.83 137.13,18.75 136.12,18.75 X3.5 135.61,18.24 134.59,17.22 132.56,17.22 126.97,11.63 78.21,11.63 X9.5
N$69  (via drill 0.61)  (1 unrouted)
  Top 0.254: v134.59,64.47 134.59,29.92 135.61,28.91 X3.13
  Bottom 0.254: v134.59,64.47 104.62,94.44 91.41,94.44 86.33,99.52 R22.1
N$71  (1 unrouted)
  Bottom 0.254: R19.1 45.69,94.95 46.71,95.96 61.95,95.96 64.49,93.42 102.08,93.42 135.61,59.89 135.61,31.45 X3.15
N$76  (1 unrouted)
  Top 0.254: DIS3.P$3 112.75,113.23 112.75,99.52 118.85,93.42 118.85,42.11 119.35,41.61 119.35,40.59 119.86,40.08 125.45,40.08 125.45,41.1 X4.1
N$77  (1 unrouted)
  Top 0.254: R29.1 125.45,95.96 122.91,93.42 122.91,43.64 120.88,41.61 X4.5
N$79  (1 unrouted)
  Top 0.254: R26.1 108.69,99.52 112.24,95.96 112.24,58.37 114.78,55.83 114.78,44.65 117.83,41.61 X4.7
N$82  (1 unrouted)
  Top 0.254: R31.1 135.61,96.98 131.55,101.04 126.47,101.04 126.47,44.65 123.42,41.61 X4.3
N$84  (via drill 0.61)  (1 unrouted)
  Top 0.254: v42.65,88.85 33.5,97.99 33.5,108.66 28.42,113.74 DIS2.P$3
  Bottom 0.254: v42.65,88.85 64.49,67.01 84.81,67.01 91.41,60.4 103.61,60.4 109.19,54.81 109.19,42.62 111.73,42.62 112.75,41.61 X4.11
N$85  (via drill 0.61)  (1 unrouted)
  Top 0.254: v107.67,64.47 107.67,41.61 X4.15
  Bottom 0.254: v107.67,64.47 81.25,90.88 27.91,90.88 24.36,94.44 R15.1
N$87
  Top 0.254: D2.C 41.63,30.94 44.17,33.48 44.17,38.56 IC6.1
  Bottom 0.254: C5.2 32.99,32.46 34.52,30.94 41.12,30.94 D2.C
N$88
  Top 0.254: 27.41,140.67 31.47,144.73 31.47,145.24 LED4.A | 27.41,140.67 23.34,136.6 R9.2 | 27.41,140.67 27.41,141.17 23.34,145.24 LED3.A
N$89
  Top 0.254: 49.25,145.24 48.23,144.22 48.23,138.63 46.2,136.6 R8.2 | 49.25,145.24 41.12,145.24 LED5.A | 49.25,145.24 LED6.A
N$90
  Top 0.254: 57.38,145.24 58.39,144.22 58.39,137.62 59.41,136.6 R7.2 | 57.38,145.24 66.01,145.24 LED8.A | 57.38,145.24 LED7.A
N$91
  Bottom 0.254: D2.A 51.28,30.43 38.07,17.22 38.07,13.16 S2.2
N$92
  Top 0.254: 83.79,145.24 82.78,144.22 82.78,136.6 R6.2 | 83.79,145.24 75.16,145.24 LED9.A | 83.79,145.24 LED10.A
N$93
  Top 0.254: 92.94,145.24 93.95,144.22 93.95,139.14 96.49,136.6 R5.2 | 92.94,145.24 101.57,145.24 LED12.A | 92.94,145.24 LED11.A
N$94
  Top 0.254: LED13.A 110.72,145.24 119.35,145.24 LED14.A
  Bottom 0.254: R4.2 119.35,136.6 110.72,145.24 LED13.A
N$95
  Top 0.254: 128.5,145.24 129.51,144.22 129.51,139.14 132.05,136.6 R3.2 | 128.5,145.24 137.13,145.24 LED16.A | 128.5,145.24 LED15.A
N$97
  Top 0.254: S1.2 54.33,21.29 60.43,21.29 S1.1
N$99
  Top 0.254: X7.1 4.55,46.69 4.55,44.65 X7.2 4.04,44.15 4.04,42.11 X7.3 4.04,41.61 4.04,39.57 X7.4 4.04,39.07 4.04,37.03 X7.5 4.55,36.53 4.55,34.49 X7.6 4.55,33.99 4.55,20.27 U$1.+@4
  Bottom 0.254: S2.1 34.01,13.16 28.93,18.24 6.58,18.24 5.05,19.76 U$1.+@4 | J1.1 75.16,103.07 72.62,100.53 7.09,100.53 1.5,94.95 1.5,47.19 4.04,47.19 X7.1
N$102
  Top 0.254: R23.2 90.91,107.14 81.76,116.28 81.76,119.33 80.24,120.85 DIS4.11
N$103
  Bottom 0.254: DIS3.P$1 108.18,113.23 111.23,110.19 119.35,110.19 R28.2
N$104
  Bottom 0.254: R19.2 45.69,105.11 61.44,120.85 61.44,127.46 78.71,127.46 79.73,126.44 DIS4.13
N$105
  Bottom 0.254: DIS3.P$2 110.72,113.23 112.75,111.2 120.88,111.2 125.45,106.63 R29.2
N$106
  Bottom 0.254: DIS3.P$5 118.34,113.23 119.86,111.71 129.01,111.71 130.53,110.19 131.04,110.19 R30.2
N$107
  Bottom 0.254: DIS3.P$10 113.26,128.47 130.53,111.2 131.55,111.2 135.61,107.14 R31.2
N$108
  Top 0.254: DIS3.P$7 120.37,128.47 109.19,117.3 109.19,110.69 108.69,110.19 R26.2
N$109  (via drill 0.61)  (1 unrouted)
  Top 0.254: v101.07,43.64 101.57,44.15 101.57,95.45 102.59,96.47 R25.1
  Bottom 0.254: v101.07,43.64 107.16,37.54 114.27,37.54 115.29,38.56 X4.10
N$111  (via drill 0.61)  (1 unrouted)
  Top 0.254: v117.83,43.13 118.34,43.64 118.34,92.41 114.27,96.47 R27.1
  Bottom 0.254: v117.83,43.13 119.35,41.61 119.35,39.07 120.37,39.07 X4.6
N$113  (via drill 0.61)  (1 unrouted)
  Top 0.254: v119.86,43.64 119.86,99.52 R28.1
  Bottom 0.254: v119.86,43.64 121.89,41.61 121.89,39.07 122.91,39.07 X4.4
N$115  (1 unrouted)
  Top 0.254: R30.1 131.04,99.52 126.97,95.45 126.97,40.08 125.96,39.07 X4.2
N$116  (1 unrouted)
  Bottom 0.254: R18.1 40.11,99.01 40.11,91.39 94.97,91.39 133.07,53.29 133.07,31.45 X3.16
N$118  (via drill 0.61)  (1 unrouted)
  Top 0.254: v132.05,65.48 132.05,29.92 133.07,28.91 X3.14
  Bottom 0.254: v132.05,65.48 103.61,93.93 76.17,93.93 70.59,99.52 52.81,99.52 51.79,98.5 R20.1
N$120  (1 unrouted)
  Bottom 0.254: R21.1 57.38,94.44 58.9,92.91 101.57,92.91 134.59,59.89 134.59,26.37 133.58,26.37 X3.12
N$122  (via drill 0.61)  (2 unrouted)
  Top 0.254: X8.4 72.62,8.59 X9.4 | v96.49,85.29 96.49,91.39 91.41,96.47 R23.1 | v121.39,10.62 132.05,21.29 132.05,22.3 133.07,23.32 X3.10
  Bottom 0.254: v96.49,85.29 109.19,72.59 109.19,69.04 112.24,69.04 122.91,58.37 122.91,42.62 125.96,42.62 131.55,37.03 131.55,23.83 133.07,23.83 X3.10 | v121.39,10.62 110.72,10.62 103.1,3 74.65,3 72.62,5.03 X8.4
N$125  (via drill 0.61)  (1 unrouted)
  Top 0.254: v53.31,47.7 35.53,65.48 35.53,93.93 35.03,94.44 R17.1
  Bottom 0.254: v53.31,47.7 53.82,47.19 103.61,47.19 109.19,41.61 110.21,41.61 X4.13
N$126
  Bottom 0.254: R34.2 3.53,62.43 8.1,62.43 R33.1 8.61,61.93 15.72,54.81 21.31,54.81 S4.A2 21.82,54.31 31.47,54.31 32.99,52.78 105.13,52.78 105.64,53.29 S3.A2
N$129  (4 unrouted)
  Top 0.254: X2.10 117.83,6.05 116.81,7.06 116.81,40.08 115.8,41.1 X4.9 | X5.6 10.64,34.49 10.64,36.53 X5.5 10.64,37.03 10.64,39.07 X5.4 10.64,39.57 10.64,41.61 X5.3 10.64,42.11 10.64,44.15 X5.2 10.64,44.65 10.64,46.69 X5.1 10.13,47.19 10.13,50.24 8.61,51.77 R33.2 | X8.2 67.54,8.59 X9.2 67.54,9.09 62.97,13.67 62.97,38.05 60.43,40.59 R2.2 59.92,41.1 55.35,41.1 D1.C | C4.2 49.25,44.15 44.68,44.15 IC6.3 44.17,44.15 33.5,44.15 26.39,51.26 S4.A1
  Bottom 0.254: 116.81,20.78 131.04,20.78 133.07,18.75 X3.6 | 116.81,20.78 100.56,20.78 X1.10 | X2.10 117.83,5.54 116.81,4.52 111.73,4.52 110.72,3.51 X2.3 110.21,3 109.19,1.98 70.59,1.98 67.54,5.03 X8.2 | S3.A1 111.23,50.75 111.23,45.67 115.29,41.61 X4.9 115.8,41.1 115.8,40.08 116.81,39.07 116.81,20.78 | S4.A1 25.88,51.77 8.61,51.77 R33.2 | D1.C 54.84,41.1 51.79,44.15 49.76,44.15 C4.2
N$134  (via drill 0.61)  (2 unrouted)
  Top 0.254: v97.51,79.71 97.51,82.75 74.65,105.61 J1.2 | X2.8 115.29,6.05 114.27,7.06 114.27,44.15 112.24,46.18 112.24,57.35 111.23,58.37 S3.A
  Bottom 0.254: v97.51,79.71 110.72,66.5 110.72,58.88 S3.A
(copper drawn outside any net)
  shapes: Top area x3130

### Text on the board
Top: STEERING WHEEL SYSTEM